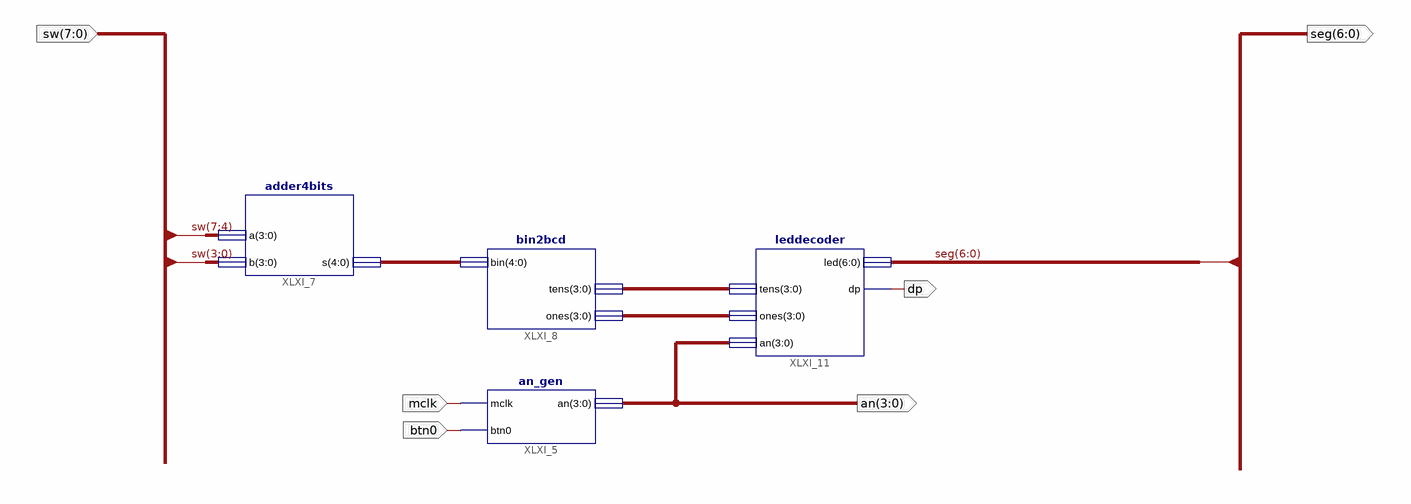
[diagram p0: schematic sheet 1]
// Xilinx ISE schematic adder.sch (spartan3e) as structural Verilog: 4 symbols, 6 ports
module adder (
  input  [7:0] sw,
  input  mclk,
  input  btn0,
  output [6:0] seg,
  output [3:0] an,
  output dp
);

  wire [3:0] XLXN_3, XLXN_4;
  wire [4:0] XLXN_5;

  an_gen XLXI_5 (.mclk(mclk), .btn0(btn0), .an(an));
  adder4bits XLXI_7 (.a(sw[7:4]), .b(sw[3:0]), .s(XLXN_5));
  bin2bcd XLXI_8 (.bin(XLXN_5), .tens(XLXN_4), .ones(XLXN_3));
  leddecoder XLXI_11 (.tens(XLXN_4), .ones(XLXN_3), .an(an), .dp(dp), .led(seg));
endmodule
